# Altium project PCB_Project4.PrjPCB
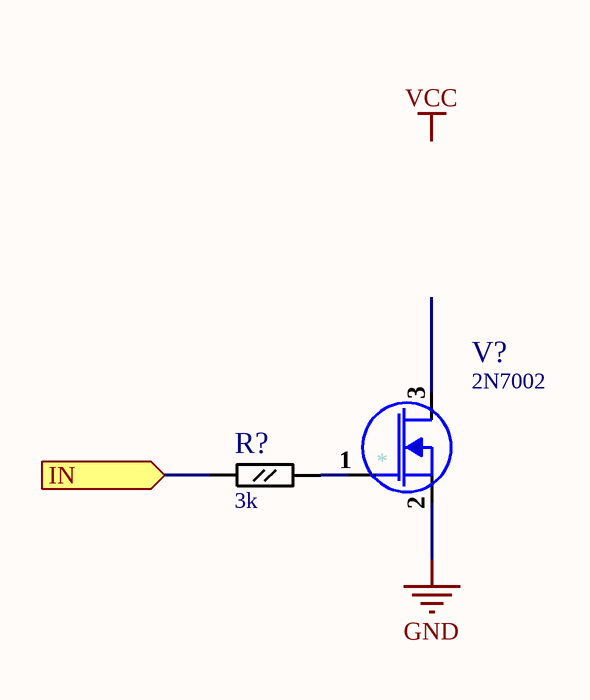
[diagram p0: Sheet2.SchDoc]
3 sheets, 54 parts. Net scope: hierarchical (ports join the sheet entries above them; power ports are global).
Sheets:
  Sheet2.SchDoc
  MainSheet.SchDoc
    U_Sheet1 = Sheet1.SchDoc
    U_Sheet2 = Sheet1.SchDoc
    U_Sheet3 = Sheet1.SchDoc

## Sheet Sheet2.SchDoc
size 209 x 297 mm; Scale: 1:1; DocumentType: Схема электрическая принципиальная; FirstReferrence: АБВГ.123456.001

### Parts
(Parts that share a designator on the sheet are numbered #1, #2 ... from top to bottom, then left to right.)
R?#1  value 3k  [R0805]  (hidden comment: R0805-0,125 W)
V?#1  2N7002  [SOT-23]

### Ports
IN (in)

### Nets
GND: V?#1.2(S)
NetR?#1_1: R?#1.1 ; port IN
NetR?#1_2: R?#1.2 V?#1.1(G)

Not connected (* = marked no-connect by the designer): V?#1 3(D)

### Notes on the sheet
- Labels drawn without touching a wire or pin: VCC
- Перв. примен.
- Справ. №
- Подп. и дата
- Инв. № дубл.
- Взам. инв. №
- Разраб.
- Изм.
- Лист
- № докум.
- Подп.
- Дата
- Лит.
- Масса
- Масштаб
- Пров.
- Т.контр.
- Листов
- Инв. № подл.
- Утв.
- Н.контр.
- 2.106-A4
- Копировал
- Формат А4

### Library data of the parts
R?#1 = Resistor 0805 100: TitAD: Резистор; Part Number: Resistor 0805 100; Корпус: R0805
V?#1 = 2N7002: TitAD: Транзистор; Part Number: 2N7002; ManufacturerPartNumber: 2N7002; Корпус: SOT-23

## Sheet MainSheet.SchDoc
size 420 x 297 mm; Scale: 1:1; DocumentType: Схема электрическая принципиальная; FirstReferrence: АБВГ.123456.001
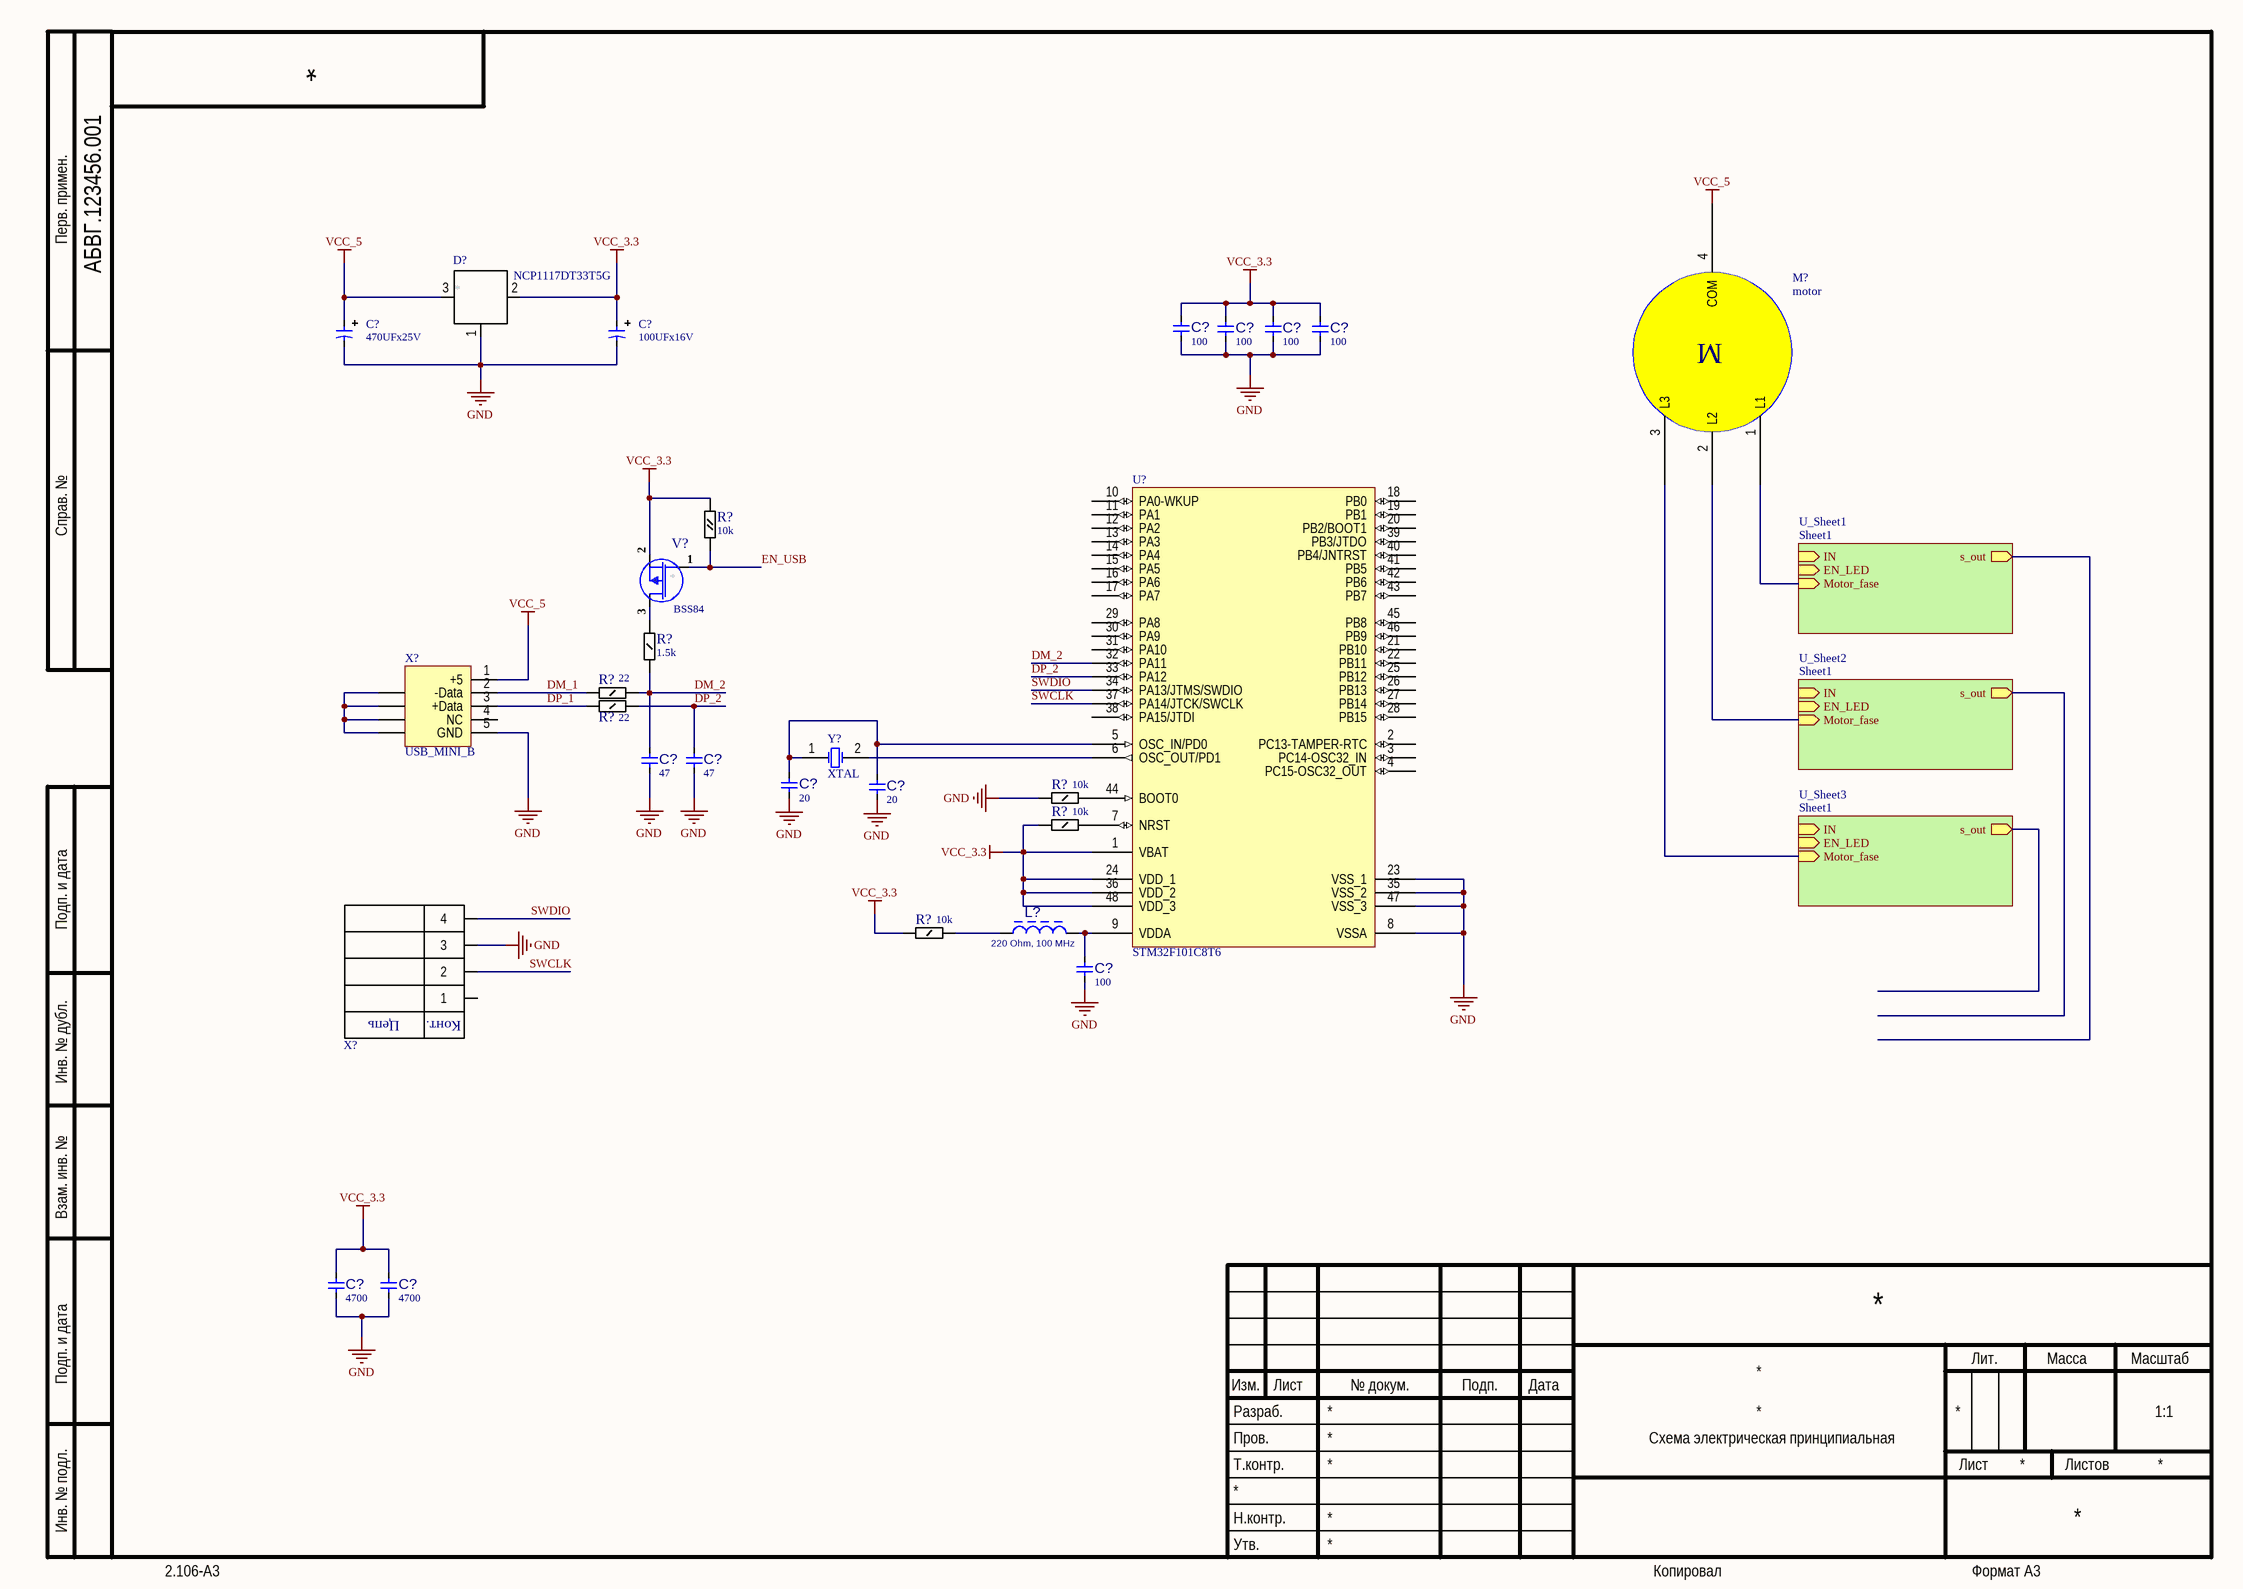
[diagram p1: MainSheet.SchDoc]

### Parts
(Parts that share a designator on the sheet are numbered #1, #2 ... from top to bottom, then left to right.)
C?#1  value 100  [C1206]  (hidden comment: C1206)
C?#2  value 100  [C1206]  (hidden comment: C1206)
C?#3  value 100  [C1206]  (hidden comment: C1206)
C?#4  value 100  [C1206]  (hidden comment: C1206)
C?#5  value 470UFx25V  [C15x8]  (hidden comment: C15x8)
C?#6  value 100UFx16V  [C12x5]  (hidden comment: C15x8)
C?#7  value 47  [C1206]  (hidden comment: C1206)
C?#8  value 47  [C1206]  (hidden comment: C1206)
C?#9  value 20  [C1206]  (hidden comment: C1206)
C?#10  value 20  [C1206]  (hidden comment: C1206)
C?#11  value 100  [C1206]  (hidden comment: C1206)
C?#12  value 4700  [C1206]  (hidden comment: C1206)
C?#13  value 4700  [C1206]  (hidden comment: C1206)
D?  NCP1117DT33T5G  [TO-252(DPAK)]
L?  220 Ohm, 100 MHz  [R0805]
M?  motor
R?#2  value 10k  [R0805]  (hidden comment: R0805-0,125 W)
R?#3  value 1.5k  [R1206]  (hidden comment: R1206-0,25 W)
R?#4  value 22  [R1206]  (hidden comment: R1206-0,25 W)
R?#5  value 22  [R1206]  (hidden comment: R1206-0,25 W)
R?#6  value 10k  [R1206]  (hidden comment: R1206-0,25 W)
R?#7  value 10k  [R1206]  (hidden comment: R1206-0,25 W)
R?#8  value 10k  [R1206]  (hidden comment: R1206-0,25 W)
U?  STM32F101C8T6  [LQFP48_N]
V?#2  BSS84  [SOT-23]
X?#1  USB_MINI_B  [USB/SM0.8-6H5]
X?#2  PLS-4R  [PLS-4R]  (value not drawn)
Y?  XTAL  [HC49/4H_SMX]

### Sub-sheets
U_Sheet1 = Sheet1: s_out (out), IN (in), EN_LED (in), Motor_fase (in)
U_Sheet2 = Sheet1: s_out (out), IN (in), EN_LED (in), Motor_fase (in)
U_Sheet3 = Sheet1: s_out (out), IN (in), EN_LED (in), Motor_fase (in)

### Nets
GND: C?#1.1 C?#2.1 C?#3.1 C?#4.1 C?#5.2 C?#6.2 C?#7.1 C?#8.1 C?#9.1 C?#10.1 C?#11.1 C?#12.1 C?#13.1 D?.1(GND) R?#6.1 U?.8(VSSA) U?.23(VSS_1) U?.35(VSS_2) U?.47(VSS_3) X?#1.5(GND) X?#2.3
VCC_3.3: C?#1.2 C?#2.2 C?#3.2 C?#4.2 C?#6.1 C?#12.2 C?#13.2 D?.2(Out) R?#2.2 R?#7.1 R?#8.1 U?.1(VBAT) U?.24(VDD_1) U?.36(VDD_2) U?.48(VDD_3) V?#2.2(S)
VCC_5: C?#5.1 D?.3(Vin) M?.4(COM) X?#1.1(+5)
DM_1: R?#4.1 X?#1.2(-Data)
DM_2: C?#7.2 R?#3.1 R?#4.2 U?.32(PA11)
DP_1: R?#5.1 X?#1.3(+Data)
DP_2: C?#8.2 R?#5.2 U?.33(PA12)
EN_USB: R?#2.1 V?#2.1(G)
SWCLK: U?.37(PA14/JTCK/SWCLK) X?#2.2
SWDIO: U?.34(PA13/JTMS/SWDIO) X?#2.4
NetC?#9_2: C?#9.2 C?#10.2 U?.5(OSC_IN/PD0) Y?.1(OSC1)
NetC?#11_2: C?#11.2 L?.2 U?.9(VDDA)
NetL?_1: L?.1 R?#8.2
NetM?_1: M?.1(L1) ; sheet U_Sheet1/Motor_fase
NetM?_2: M?.2(L2) ; sheet U_Sheet2/Motor_fase
NetM?_3: M?.3(L3) ; sheet U_Sheet3/Motor_fase
NetR?#3_2: R?#3.2 V?#2.3(D)
NetR?#6_2: R?#6.2 U?.44(BOOT0)
NetR?#7_2: R?#7.2 U?.7(NRST)
NetU?_6: U?.6(OSC_OUT/PD1) Y?.2(OSC2)
NetX?#1_6: X?#1.6 X?#1.7 X?#1.8 X?#1.9

Not connected (* = marked no-connect by the designer): U? 2(PC13-TAMPER-RTC) 3(PC14-OSC32_IN) 4(PC15-OSC32_OUT) 10(PA0-WKUP) 11(PA1) 12(PA2) 13(PA3) 14(PA4) 15(PA5) 16(PA6) 17(PA7) 18(PB0) 19(PB1) 20(PB2/BOOT1) 21(PB10) 22(PB11) 25(PB12) 26(PB13) 27(PB14) 28(PB15) 29(PA8) 30(PA9) 31(PA10) 38(PA15/JTDI) 39(PB3/JTDO) 40(PB4/JNTRST) 41(PB5) 42(PB6) 43(PB7) 45(PB8) 46(PB9); X?#1 4(NC); X?#2 1

### Notes on the sheet
- Перв. примен.
- Справ. №
- Подп. и дата
- Инв. № дубл.
- Взам. инв. №
- Разраб.
- Изм.
- Лист
- № докум.
- Подп.
- Дата
- Лит.
- Масса
- Масштаб
- Пров.
- Т.контр.
- Листов
- Инв. № подл.
- Утв.
- Н.контр.
- 2.106-A3
- Копировал
- Формат А3
- (in symbol bldc motor) M
- (in symbol Разъем PLS-4R) Цепь; Конт.

### Library data of the parts
C?#1-C?#4 C?#11 = Condensator 1206 100: TitAD: Конденсатор; Part Number: Condensator 1206 100
C?#5 = Condensator C15x8: TitAD: Конденсатор; Part Number: Condensator C15x8
C?#6 = Condensator C12x8: TitAD: Конденсатор; Part Number: Condensator C12x8
C?#7 C?#8 = Condensator 1206 47: TitAD: Конденсатор; Part Number: Condensator 1206 47
C?#9 C?#10 C?#12 C?#13 = Condensator 1206 20: TitAD: Конденсатор; Part Number: Condensator 1206 20
D? = NCP1117DT33T5G: Manufacturer: Onsemi; Part Number: NCP1117DT33T5G; ManufacturerPartNumber: NCP1117DT33T5G
L? = BLM21PG221SN1D: Корпус: 805; Value: 220 Ohm, 100 MHz; Part Number: BLM21PG221SN1D; ManufacturerPartNumber: BLM21PG221SN1D
M? = bldc motor: Part Number: bldc motor
R?#2 = Resistor 0805 1k: TitAD: Резистор; Part Number: Resistor 0805 1k; Корпус: R0805
R?#3 = Resistor 1206 1.5k: TitAD: Резистор; Part Number: Resistor 1206 1.5k
R?#4 R?#5 = Resistor 1206 22: TitAD: Резистор; Part Number: Resistor 1206 22; Корпус: R1206
R?#6-R?#8 = Resistor 1206 10k: TitAD: Резистор; Part Number: Resistor 1206 10k
U? = STM32F101C8T6: STM32 ARM-based 32-bit MCU with 64 Kbytes Flash, 48-pin LQFP, Industrial Temperature; Published: 30-May-2008; DatasheetVersion: rev6, Mar-2008; PackageVersion: Mar-2008; PackageReference: LQFP48; Publisher: Altium Limited; PackageDescription: 48-Pin Low-Profile Quad Flat Pack, 7 x 7 mm Body, 0.5 mm Pitch (LQFP48); ComponentLink1Description: Manufacturer Link; ComponentLink1URL: www.st.com/stm32; ComponentLink2Description: Datasheet; ComponentLink2URL: http://www.st.com/stonline/products/literature/ds/13586.pdf
V?#2 = BSS84: TitAD: Транзистор; Supplier 1: Farnell; Supplier Part Number 1: 1510765; Part Number: BSS84; ManufacturerPartNumber: BSS84; Корпус: SOT-23
X?#1 = USB mini B: TitAD: Разъем; Part Number: USB mini B
X?#2 = Разъем PLS-4R: TitAD: Разъем; Part Number: Разъем PLS-4R
Y? = XTAL: Crystal Oscillator; Published: 8-Jun-2000; LatestRevisionDate: 17-Jul-2002; LatestRevisionNote: Re-released for DXP Platform.; PackageReference: R38; Publisher: Altium Limited; PackageDescription: Crystal, Thru-Hole; 2 Leads; Body 3.1 x 8.2 mm (Dia.xH)

## Sheet Sheet1.SchDoc
size 209 x 297 mm; Address1: Address1; Address2: Address2; Address3: Address3; Address4: Address4; DocumentNumber: АБВГ.123456.001 Э3; SheetNumber: 1; SheetTotal: 1; Scale: 1:1; DocumentType: Схема электрическая принципиальная; FirstReferrence: АБВГ.123456.001
Used 3 times, as channels U_Sheet1, U_Sheet2, U_Sheet3. Parts and nets are listed once, with the designators drawn on the sheet.
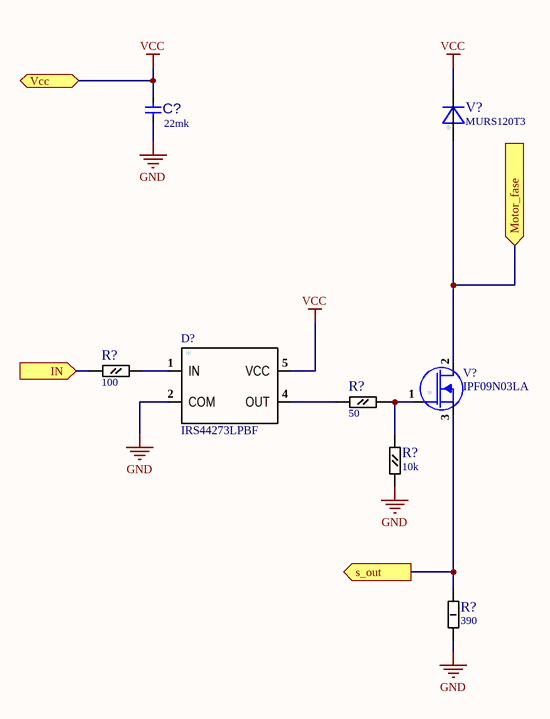
[diagram p2: Sheet1.SchDoc]

### Parts
(Parts that share a designator on the sheet are numbered #1, #2 ... from top to bottom, then left to right.)
C?  value 22mk  [C1210]  (hidden comment: C1210)
D?  IRS44273LPBF  [SOT23-5]
R?#1  value 100  [R0805]  (hidden comment: R0805-0,125 W)
R?#2  value 50  [R0805]  (hidden comment: R0805-0,125 W)
R?#3  value 10k  [R0805]  (hidden comment: R0805-0,125 W)
R?#4  value 390  [R2512]  (hidden comment: R2512-1 W)
V?#1  MURS120T3  [SMB]
V?#2  IPF09N03LA  [TO-252(DPAK)]

### Ports
IN (in), Motor_fase (in), s_out (out), Vcc

### Nets
GND: C?.1 D?.2(COM) R?#3.1 R?#4.1
VCC: C?.2 D?.5(VCC) V?#1.1(K) ; port Vcc
IN: R?#1.1 ; port IN
Motor_fase: V?#1.2(A) V?#2.2(D) ; port Motor_fase
s_out: R?#4.2 V?#2.3(S) ; port s_out
NetD?_1: D?.1(IN) R?#1.2
NetD?_4: D?.4(OUT) R?#2.1
NetR?#2_2: R?#2.2 R?#3.2 V?#2.1(G)

### Channels
U_Sheet1: designators C?=C?_U_Sheet1 D?=D?_U_Sheet1 R?=R?_U_Sheet1#3 R?=R?_U_Sheet1#1 R?=R?_U_Sheet1#4 R?=R?_U_Sheet1#2 V?=V?_U_Sheet1#2 V?=V?_U_Sheet1#1; ports IN=NetR?_U_Sheet1#1_1 Motor_fase=NetM?_1 s_out=NetR?_U_Sheet1#4_2 Vcc=VCC
U_Sheet2: designators C?=C?_U_Sheet2 D?=D?_U_Sheet2 R?=R?_U_Sheet2#3 R?=R?_U_Sheet2#1 R?=R?_U_Sheet2#4 R?=R?_U_Sheet2#2 V?=V?_U_Sheet2#2 V?=V?_U_Sheet2#1; ports IN=NetR?_U_Sheet2#1_1 Motor_fase=NetM?_2 s_out=NetR?_U_Sheet2#4_2 Vcc=VCC
U_Sheet3: designators C?=C?_U_Sheet3 D?=D?_U_Sheet3 R?=R?_U_Sheet3#3 R?=R?_U_Sheet3#1 R?=R?_U_Sheet3#4 R?=R?_U_Sheet3#2 V?=V?_U_Sheet3#2 V?=V?_U_Sheet3#1; ports IN=NetR?_U_Sheet3#1_1 Motor_fase=NetM?_3 s_out=NetR?_U_Sheet3#4_2 Vcc=VCC

### Notes on the sheet
- Перв. примен.
- Справ. №
- Подп. и дата
- Инв. № дубл.
- Взам. инв. №
- Разраб.
- Изм.
- Лист
- № докум.
- Подп.
- Дата
- Лит.
- Масса
- Масштаб
- Пров.
- Т.контр.
- Листов
- Инв. № подл.
- Утв.
- Н.контр.
- 2.106-A4
- Копировал
- Формат А4

### Library data of the parts
C? = Condensator 1210 47mk: TitAD: Конденсатор; Part Number: Condensator 1210 47mk
D? = IRS44273LPBF: TitAD: Драйвер MOSFET; Part Number: IRS44273LPBF
R?#1-R?#3 = Resistor 0805 100: TitAD: Резистор; Part Number: Resistor 0805 100; Корпус: R0805
R?#4 = Resistor 2512 390: TitAD: Резистор; Part Number: Resistor 2512 390
V?#1 = MURS120T3: TitAD: Ultrafast Power Rectifiers; Supplier 1: Mouser; Supplier Part Number 1: 625-1N4007E-E3/73; Part Number: MURS120T3; Корпус: SMB
V?#2 = IPF09N03LA: TitAD: Транзистор; Part Number: IPF09N03LA; ManufacturerPartNumber: IPF09N03LA; Корпус: TO-252(DPAK)

## Nets that join several sheets
GND: Sheet2 (V?#1.2), MainSheet (21 pins), U_Sheet1 (C?_U_Sheet1.1 D?_U_Sheet1.2 R?_U_Sheet1#3.1 R?_U_Sheet1#4.1), U_Sheet2 (C?_U_Sheet2.1 D?_U_Sheet2.2 R?_U_Sheet2#3.1 R?_U_Sheet2#4.1), U_Sheet3 (C?_U_Sheet3.1 D?_U_Sheet3.2 R?_U_Sheet3#3.1 R?_U_Sheet3#4.1)
VCC: U_Sheet1 (C?_U_Sheet1.2 D?_U_Sheet1.5 V?_U_Sheet1#1.1), U_Sheet2 (C?_U_Sheet2.2 D?_U_Sheet2.5 V?_U_Sheet2#1.1), U_Sheet3 (C?_U_Sheet3.2 D?_U_Sheet3.5 V?_U_Sheet3#1.1)
NetM?_1: MainSheet (M?.1), U_Sheet1 (V?_U_Sheet1#1.2 V?_U_Sheet1#2.2)
NetM?_2: MainSheet (M?.2), U_Sheet2 (V?_U_Sheet2#1.2 V?_U_Sheet2#2.2)
NetM?_3: MainSheet (M?.3), U_Sheet3 (V?_U_Sheet3#1.2 V?_U_Sheet3#2.2)